# EasyEDA schematic motion-detector-easy_eda.json
TITLE: Sheet_1; REV: 1.0; Date: 2019-06-20; Sheet: 1/1; Drawn By: mirko.haeberlin; Company: Your Company
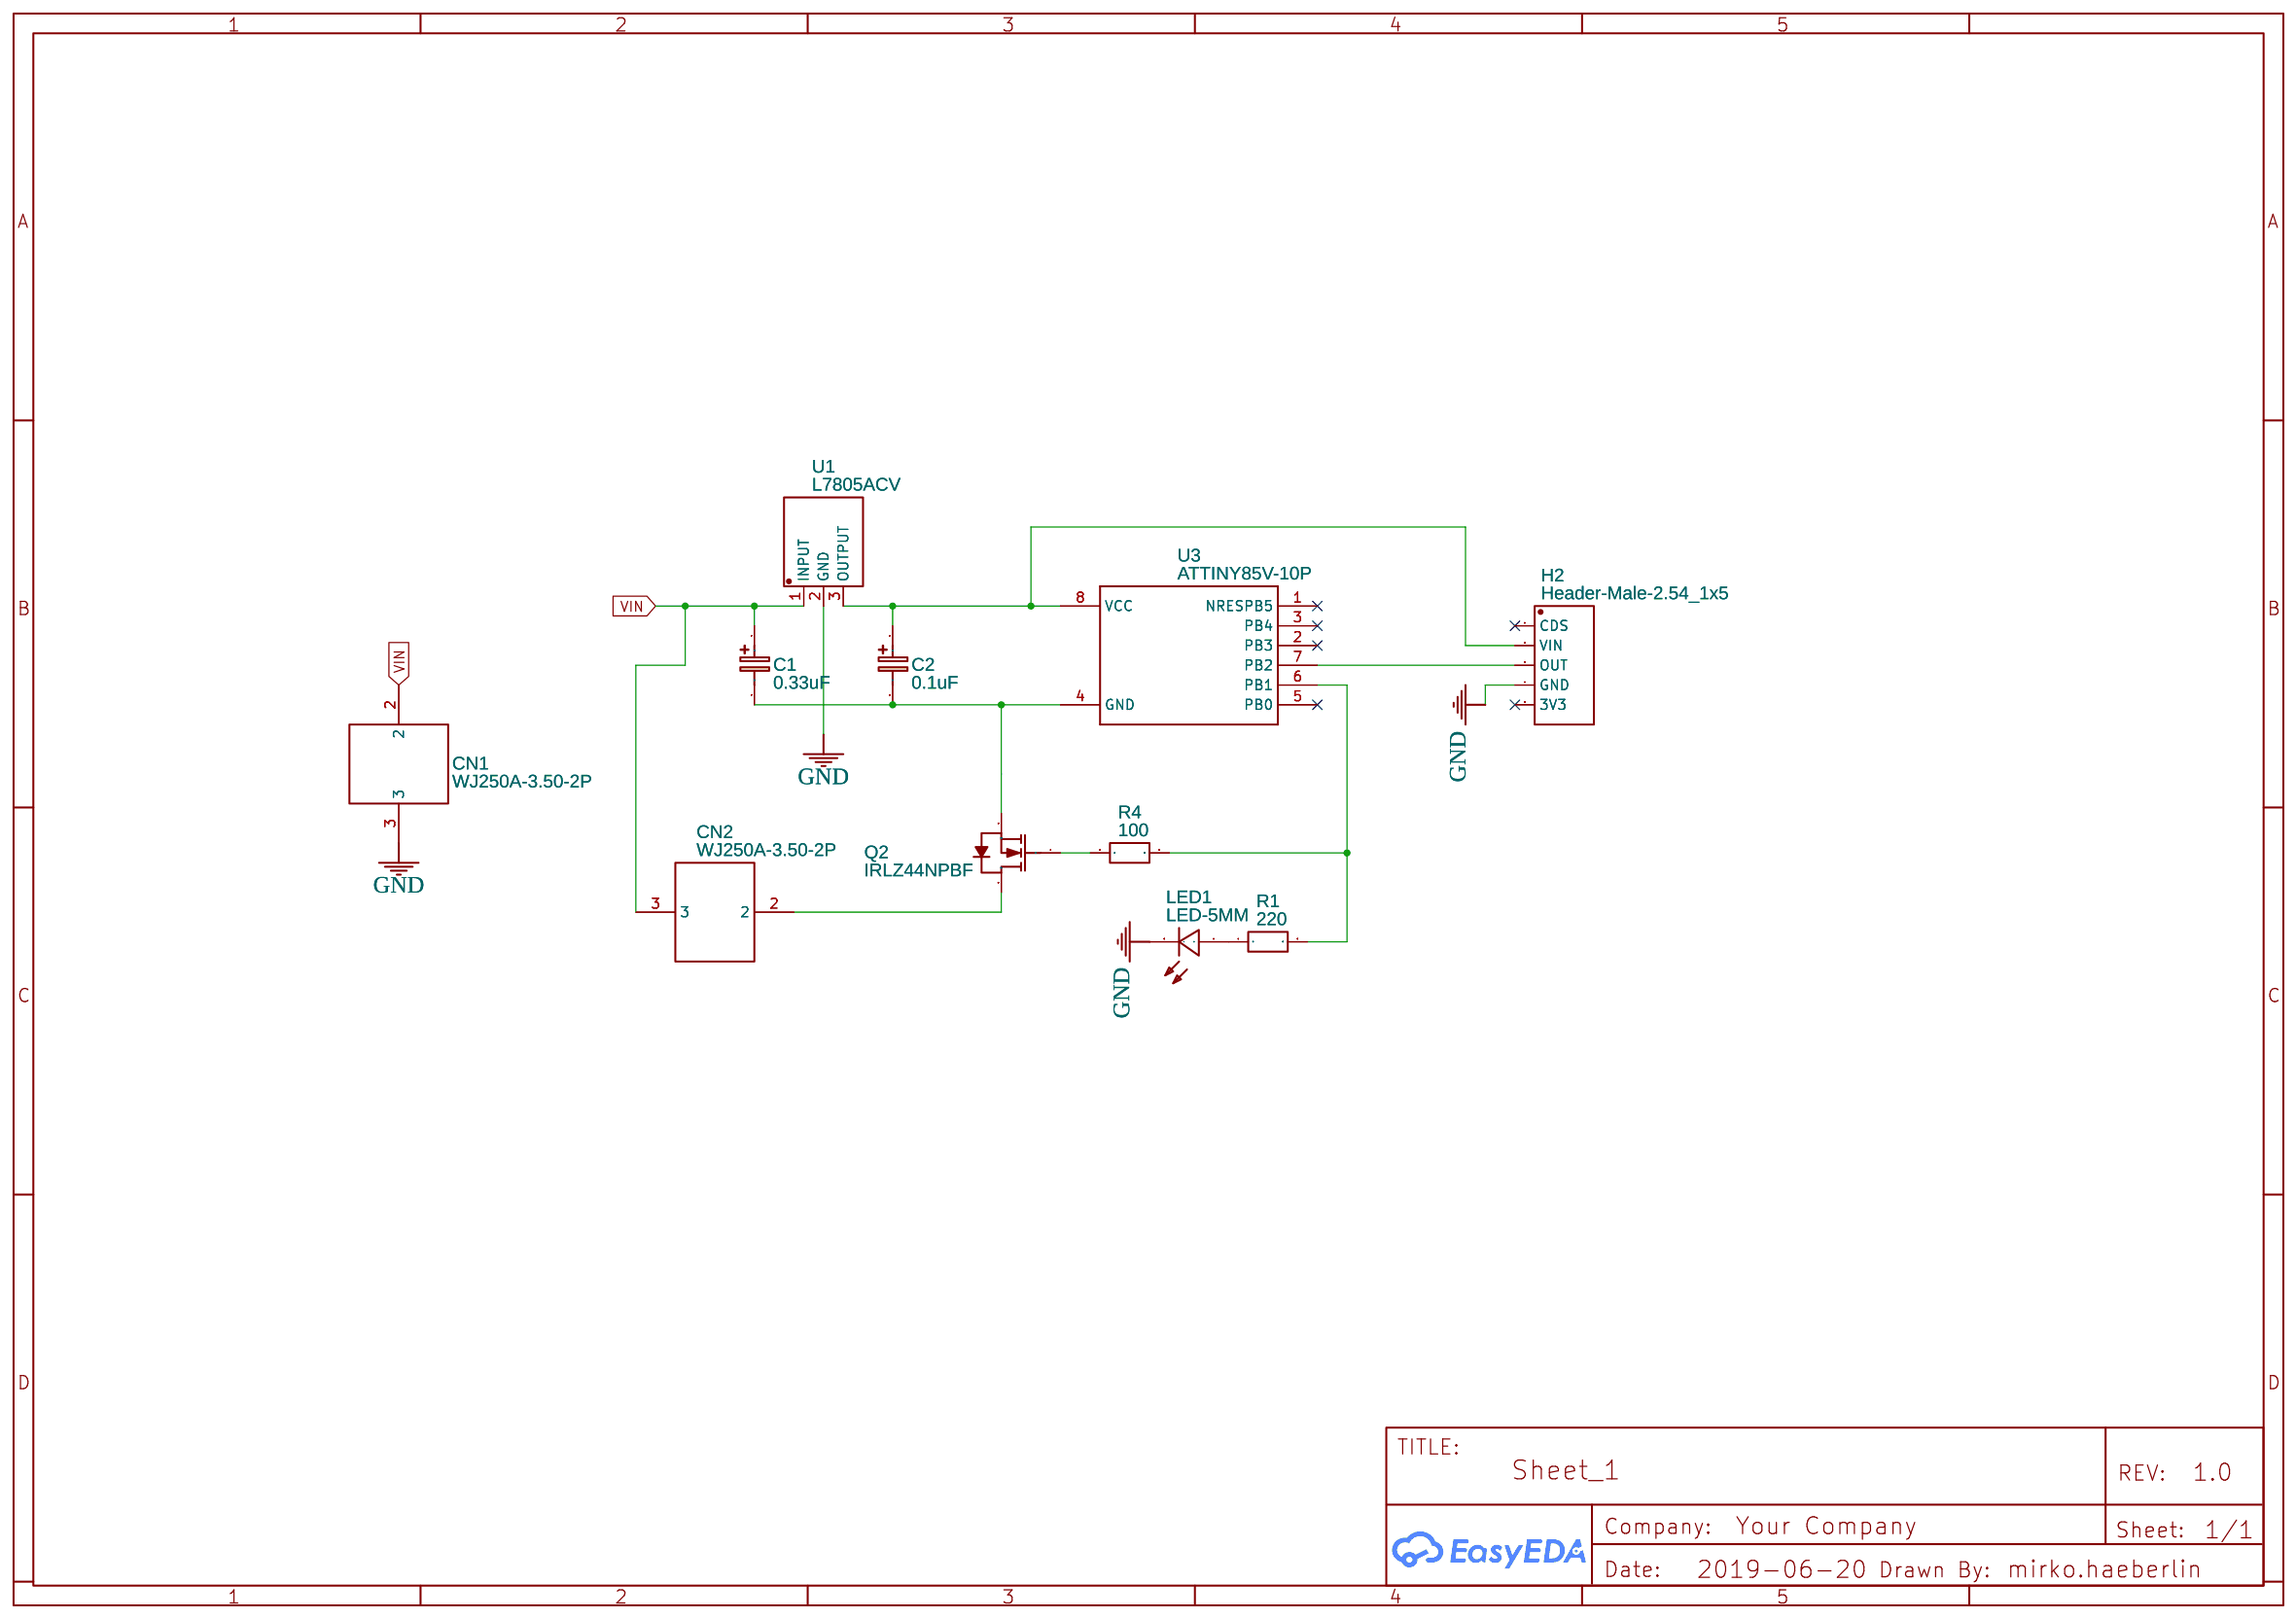
[diagram p0: schematic sheet]

## Parts
C1  0.33uF  [CAP-D3.0XF1.5]
C2  0.1uF  [CAP-D3.0XF1.5]
CN1  WJ250A-3.50-2P  [WJ250A-3.50-2P]
CN2  WJ250A-3.50-2P  [WJ250A-3.50-2P]
H2  Header-Male-2.54_1x5  [DIP-1X5P-2.54MM-M]
LED1  LED-5MM  [LED-5MM/2.54]
Q2  IRLZ44NPBF  [TO-220(TO-220-3)]
R1  220  [AXIAL-0.4]
R4  100  [AXIAL-0.4]
U1  L7805ACV  [TO-220-3]
U3  ATTINY85V-10P  [PDIP08_300MIL]

## Library data of the parts
C1 C2 = Cap_Electrolytic(TH)_D3.0XF1.5_EU: Contributor: EasyEDA; Manufacturer Part: ?
CN1 CN2 = -: Supplier: LCSC; Manufacturer: ReliaPro; image: //image.lceda.cn/szlcsc/C8421.jpg; Supplier Part: C8421
H2 = -: Supplier: LCSC; Manufacturer: Ckmtw; Manufacturer Part: 210S-1*5P L=11.6MMGold-plated black; Contributor: LCSC; Supplier Part: C124379
LED1 = -: Supplier: LCSC; Manufacturer: EVERLIGHT; Manufacturer Part: 5AR2ST10; Supplier Part: C52721
Q2 = -: Supplier: LCSC; Manufacturer: IR; Supplier Part: C38774
R1 R4 = Res_AXIAL-0.4(1/4W)_EU: Manufacturer Part: ?
U1 = -: Supplier: LCSC; Supplier Part: C192854; Manufacturer: STMicroelectronics; Contributor: LCSC
U3 = -: Manufacturer Part: ?

## Nets
GND: CN1.3 H2.4(GND) LED1.2(-) U1.2(GND)
VIN: C1.1 CN1.2 CN2.3 U1.1(INPUT)
Net-(C1-2): C1.2 C2.2 Q2.3(S) U3.4(GND)
Net-(C2-1): C2.1 H2.2(VIN) U1.3(OUTPUT) U3.8(VCC)
Net-(CN2-2): CN2.2 Q2.2(D)
Net-(H2-3): H2.3(OUT) U3.7(PB2)
Net-(LED1-1): LED1.1(+) R1.1
Net-(Q2-1): Q2.1(G) R4.1
Net-(R1-2): R1.2 R4.2 U3.6(PB1)

Not connected (* = marked no-connect by the designer): H2 1(CDS)* 5(3V3)*; U3 1(NRESPB5)* 2(PB3)* 3(PB4)* 5(PB0)*
